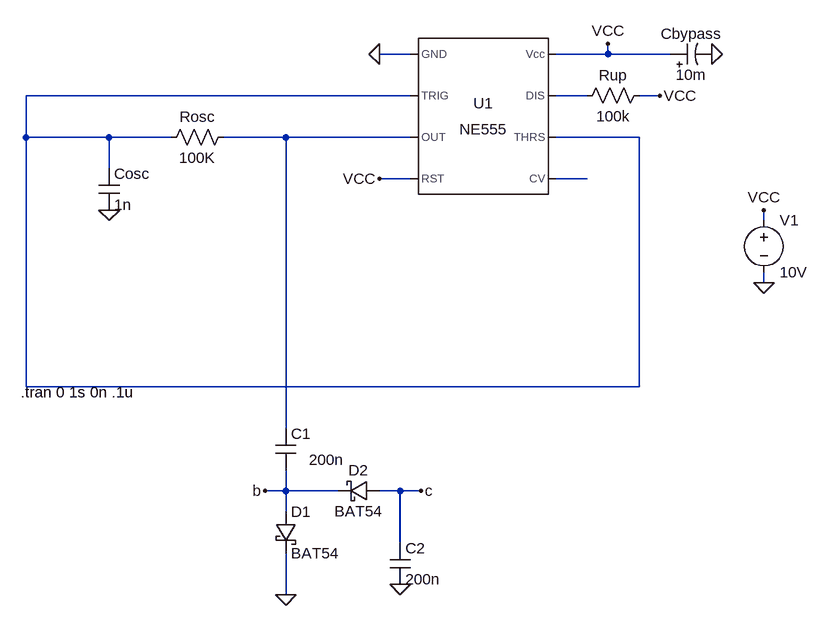
[diagram p0: schematic Negative DC Converter.asc]
Negative DC Converter.asc, the LTspice schematic file:
Version 4
SHEET 1 984 948
WIRE 192 96 144 96
WIRE 496 96 496 80
WIRE 496 96 416 96
WIRE 592 96 496 96
WIRE 192 160 -400 160
WIRE 464 160 416 160
WIRE 576 160 544 160
WIRE -400 224 -400 160
WIRE -272 224 -400 224
WIRE -176 224 -272 224
WIRE 0 224 -96 224
WIRE 192 224 0 224
WIRE 544 224 416 224
WIRE -272 272 -272 224
WIRE 192 288 144 288
WIRE 464 288 416 288
WIRE 736 352 736 336
WIRE 736 448 736 432
WIRE -400 608 -400 224
WIRE 544 608 544 224
WIRE 544 608 -400 608
WIRE 0 672 0 224
WIRE 0 768 0 736
WIRE 0 768 -32 768
WIRE 80 768 0 768
WIRE 176 768 144 768
WIRE 208 768 176 768
WIRE 0 800 0 768
WIRE 176 848 176 768
WIRE 0 928 0 864
FLAG 144 96 0
FLAG 144 288 VCC
FLAG 656 96 0
FLAG 576 160 VCC
FLAG 0 928 0
FLAG -32 768 b
FLAG 176 912 0
FLAG 208 768 c
FLAG 736 448 0
FLAG 736 336 VCC
FLAG 496 80 VCC
FLAG -272 336 0
SYMBOL Misc\\NE555 304 192 R0
SYMATTR InstName U1
SYMBOL polcap 592 112 R270
WINDOW 0 32 32 VTop 2
WINDOW 3 0 32 VBottom 2
SYMATTR InstName Cbypass
SYMATTR Value 10m
SYMBOL res 560 144 R90
WINDOW 0 0 56 VBottom 2
WINDOW 3 32 56 VTop 2
SYMATTR InstName Rup
SYMATTR Value 100k
SYMBOL cap -288 272 R0
SYMATTR InstName Cosc
SYMATTR Value 1n
SYMBOL res -80 208 R90
WINDOW 0 0 56 VBottom 2
WINDOW 3 32 56 VTop 2
SYMATTR InstName Rosc
SYMATTR Value 100K
SYMBOL schottky -16 800 R0
SYMATTR InstName D1
SYMATTR Value BAT54
SYMBOL schottky 144 784 M270
WINDOW 0 32 32 VTop 2
WINDOW 3 0 32 VBottom 2
SYMATTR InstName D2
SYMATTR Value BAT54
SYMBOL cap -16 672 R0
WINDOW 3 52 48 Left 2
SYMATTR Value 200n
SYMATTR InstName C1
SYMBOL cap 160 848 R0
SYMATTR InstName C2
SYMATTR Value 200n
SYMBOL voltage 736 336 R0
SYMATTR InstName V1
SYMATTR Value 10V
TEXT -408 616 Left 2 !.tran 0 1s 0n .1u

The netlist it stands for:
* Negative DC Converter.asc
XU1 0 N001 N003 VCC N004 N001 N002 VCC NE555  ; pins GND TRIG OUT RST CV THRS DIS Vcc
Cbypass VCC 0 10m
Rup VCC N002 100k
Cosc N001 0 1n
Rosc N003 N001 100K
D1 b 0 BAT54
D2 c b BAT54
C1 N003 b 200n
C2 c 0 200n
V1 VCC 0 10V
.model D D
.lib standard.dio
.tran 0 1s 0n .1u
.lib NE555.sub
.backanno
.end